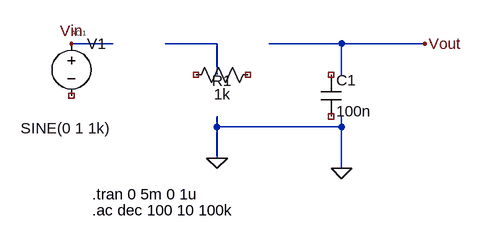
[diagram p0: schematic rc_filter_ltspice.asc]
rc_filter_ltspice.asc, the LTspice schematic file:
Version 4
SHEET 1 1200 680
WIRE -16 176 -80 176
WIRE 144 176 64 176
WIRE 336 176 224 176
WIRE 464 176 336 176
WIRE 144 224 144 176
WIRE 336 224 336 176
WIRE 336 304 336 288
WIRE 144 304 144 288
WIRE 144 304 336 304
WIRE 144 352 144 304
WIRE 336 368 336 304
FLAG -80 176 Vin
FLAG 464 176 Vout
FLAG 144 352 0
FLAG 336 368 0
SYMBOL res 208 208 R90
WINDOW 0 41 56 VBottom 2
WINDOW 3 30 56 VTop 2
SYMATTR InstName R1
SYMATTR Value 1k
SYMBOL cap 304 224 R0
SYMATTR InstName C1
SYMATTR Value 100n
SYMBOL voltage -80 160 R0
WINDOW 3 -78 146 Left 2
WINDOW 123 0 0 Left 0
WINDOW 39 0 0 Left 0
SYMATTR InstName V1
SYMATTR Value SINE(0 1 1k)
SYMATTR Value2 AC 1
TEXT -48 432 Left 2 !.ac dec 100 10 100k
TEXT -48 408 Left 2 !.tran 0 5m 0 1u

The netlist it stands for:
* rc_filter_ltspice.asc
R1 NC_01 NC_02 1k
C1 NC_03 NC_04 100n
V1 Vin NC_05 SINE(0 1 1k) AC 1
.ac dec 100 10 100k
.tran 0 5m 0 1u
.backanno
.end